# EAGLE design CAN_imp (EAGLE 6.4)
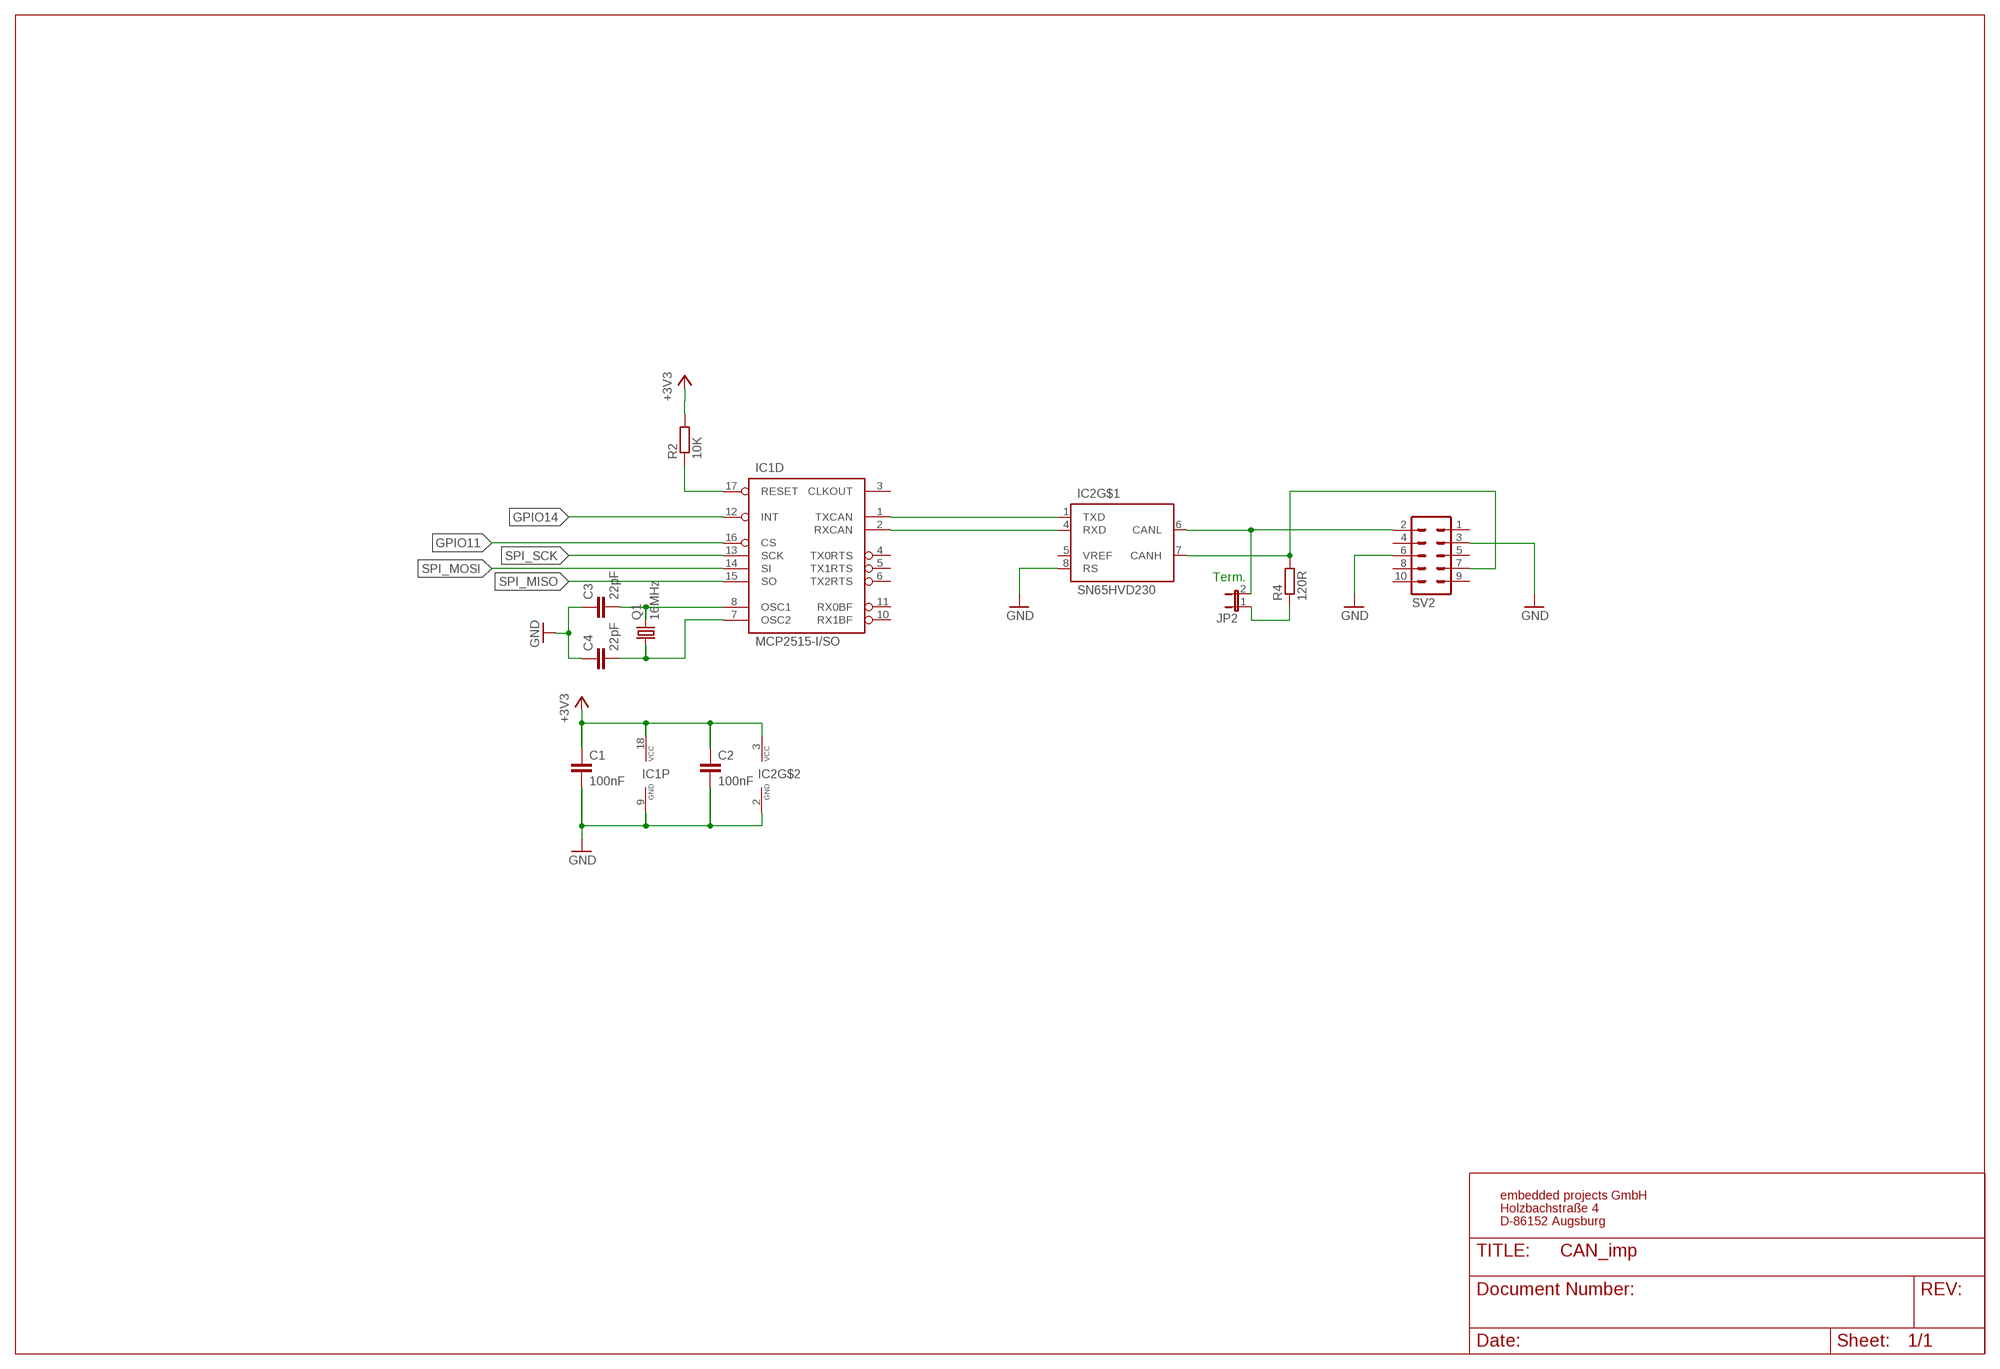
[diagram p0: schematic, sheet 1]

## Parts
C1  100nF  C-EUC0805  [C0805]
C2  100nF  C-EUC0805  [C0805]
C3  22pF  C-EUC0805  [C0805]
C4  22pF  C-EUC0805  [C0805]
IC1  MCP2515-I/SO  MCP2515SO  [SO-18W]
IC2  SN65HVD230  MCP2551SO8  [SO08]
JP2  JP1E  [JP1]
Q1  16MHz  CRYSTALHC49UP  [HC49UP]
R2  10K  R-EU_R0805  [R0805]
R4  120R  R-EU_R0805  [R0805]
SV2  ML10  [ML10]

## Nets
+3V3: C1.1 C2.1 IC1.18(P:VCC) IC2.3(VCC) R2.2
CANH: IC2.7(CANH) R4.2 SV2.7
CANL: IC2.6(CANL) JP2.2 SV2.2
GND: C1.2 C2.2 C3.1 C4.1 IC1.9(P:GND) IC2.2(GND) IC2.8(RS) SV2.3 SV2.6
GPIO11: IC1.16(D:CS)
GPIO14: IC1.12(D:INT)
N$2: C3.2 IC1.8(D:OSC1) Q1.2
N$3: C4.2 IC1.7(D:OSC2) Q1.1
N$4: IC1.1(D:TXCAN) IC2.1(TXD)
N$5: IC1.2(D:RXCAN) IC2.4(RXD)
N$6: IC1.17(D:RESET) R2.1
N$11: JP2.1 R4.1
SPI_MISO: IC1.15(D:SO)
SPI_MOSI: IC1.14(D:SI)
SPI_SCK: IC1.13(D:SCK)
Unconnected: IC1.3(D:CLKOUT) IC1.4(D:TX0RTS) IC1.5(D:TX1RTS) IC1.6(D:TX2RTS) IC1.10(D:RX1BF) IC1.11(D:RX0BF) IC2.5(VREF) SV2.1 SV2.4 SV2.5 SV2.8 SV2.9 SV2.10

## Notes on the sheet
- Term.
- embedded projects GmbH
- Holzbachstraße 4
- D-86152 Augsburg

## Library data of the parts
C1-C4 = rcl:C-EU: CAPACITOR, European symbol
IC1 = can:MCP2515: MC2515 Stand-Alone CAN Controller With SPI Interface, Microchip; FARNELL: 1292239
IC2 = can:MCP2551: CAN Tranceiver Microchip; FARNELL: 1103105
JP2 = jumper:JP1E: JUMPER
Q1 = crystal:CRYSTAL: CRYSTAL; OC_FARNELL: unknown; OC_NEWARK: unknown
R2 R4 = rcl:R-EU_: RESISTOR, European symbol
SV2 = con-ml:ML10: HARTING

## Board
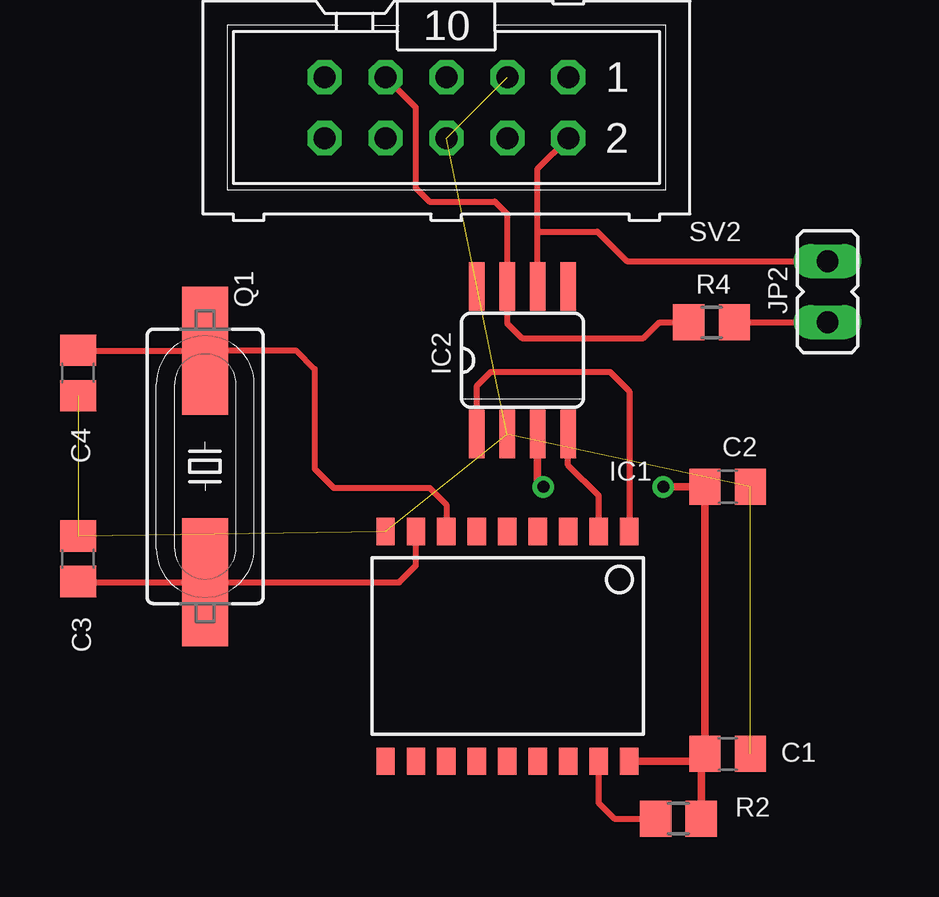
[diagram p1: board, top side]
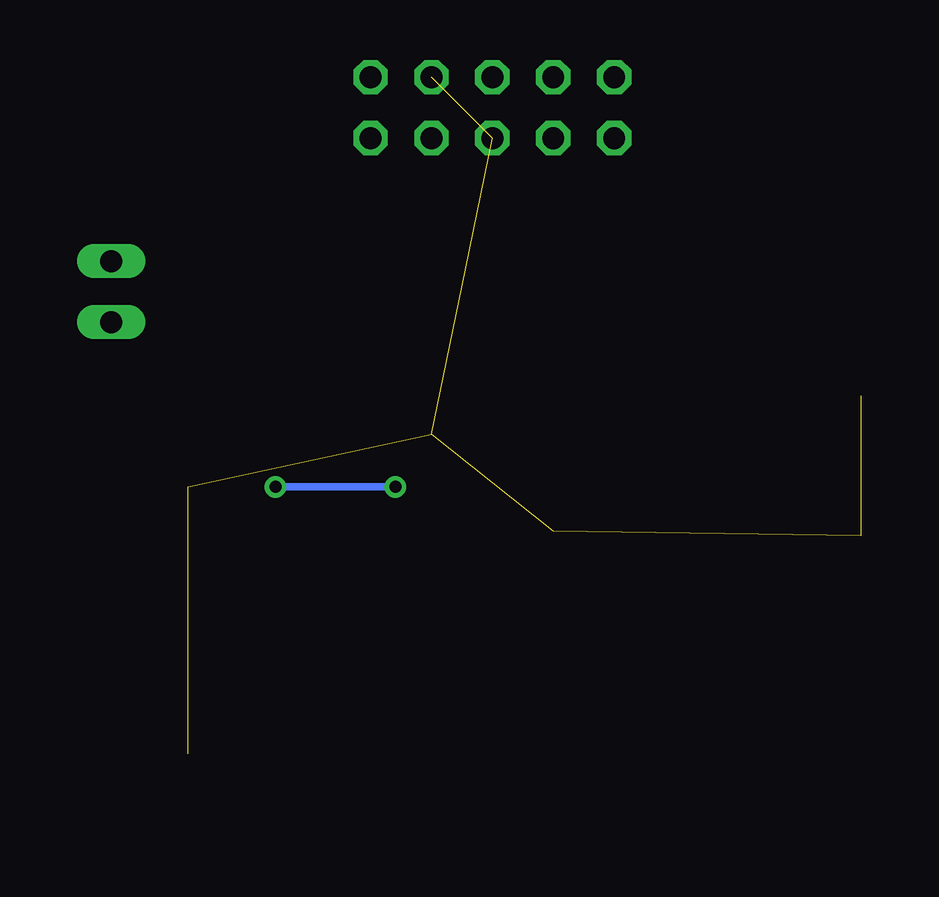
[diagram p2: board, bottom side, seen from below]

No outline drawn. Coordinates in mm, seen from the top.
Copper layers (1*16): Top 0.035mm / dielectric 1.5mm / Bottom 0.035mm
Design rules "default *": minimum track width 10mil, minimum drill 24mil, track to track 8mil, track to pad 8mil, pad to pad 8mil, via to via 8mil, smd to smd 8mil, copper to edge 20mil, drill to drill 8mil, minimum pad ring 10mil, minimum via ring 8mil, stop-mask expansion 2mil, vias tented up to drill 40mil, thermal gap 10mil

### Footprints (pad centres in the part's own frame; a part is rotated, then mirrored left to right if it is on the bottom)
C0805 = smd 1.3 x 1.5: 1 -0.95,0; 2 0.95,0
SO-18W = smd 0.762 x 1.143: 1 -5.08,-4.788; 2 -3.81,-4.788; 3 -2.54,-4.788; 4 -1.27,-4.788; 5 0,-4.788; 6 1.27,-4.788; 7 2.54,-4.788; 8 3.81,-4.788; 9 5.08,-4.788; 10 5.08,4.788; 11 3.81,4.788; 12 2.54,4.788; 13 1.27,4.788; 14 0,4.788; 15 -1.27,4.788; 16 -2.54,4.788; 17 -3.81,4.788; 18 -5.08,4.788
SO08 = smd 0.66 x 2.032: 1 -1.905,-3.073; 2 -0.635,-3.073; 3 0.635,-3.073; 4 1.905,-3.073; 5 1.905,3.073; 6 0.635,3.073; 7 -0.635,3.073; 8 -1.905,3.073
JP1 = drill 0.914 long: 1 0,-1.27; 2 0,1.27
HC49UP = smd 5.334 x 1.93: 1 -4.826,0; 2 4.826,0
R0805 = smd 1.3 x 1.5: 1 -0.95,0; 2 0.95,0
ML10 = drill 0.914 octagon: 1 -5.08,-1.27; 2 -5.08,1.27; 3 -2.54,-1.27; 4 -2.54,1.27; 5 0,-1.27; 6 0,1.27; 7 2.54,-1.27; 8 2.54,1.27; 9 5.08,-1.27; 10 5.08,1.27

### Placement (x,y rotation side)
C1  30.72,13.67 0 top
C2  30.72,24.8 0 top
C3  3.64,21.8 270 top
C4  3.64,29.54 90 top
IC1  21.54,18.15 180 top
IC2  22.17,30.07 0 top
JP2  34.89,32.93 0 top
Q1  8.94,25.65 270 top
R2  28.67,10.97 0 top
R4  30.05,31.65 180 top
SV2  19,40.6 180 top

### Tracks (layer width: path | path; a pad name or v marks a point on that pad's centre or on a via)
+3V3  (via drill 0.5)
  Top 0.305: R2.2 29.62,13.52 C1.1 | IC1.18 27.92,13.36 29.46,13.36 C1.1 | C1.1 29.77,16.13 | 29.77,16.13 29.77,16.27 | 29.77,16.27 C2.1 v28.04,24.79 | IC2.3 22.8,25.02 v23.04,24.79 | 29.77,16.13 29.77,16.27
  Bottom 0.305: v28.04,24.79 v23.04,24.79
CANH
  Top 0.254: R4.2 27.88,31.65 27.22,30.99 22.16,30.99 21.54,31.61 IC2.7 21.54,36.16 21.02,36.68 18.29,36.68 17.73,37.24 17.73,40.6 SV2.7
CANL
  Top 0.254: IC2.6 22.8,35.35 | JP2.2 26.52,34.2 25.29,35.43 22.89,35.43 22.8,35.35 | 22.8,35.35 22.8,38.05 SV2.2
GND  (8 unrouted)
N$2
  Top 0.254: IC1.8 17.73,21.52 17.03,20.82 Q1.2 3.67,20.82 C3.2
N$3
  Top 0.254: C4.2 3.65,30.48 Q1.1 12.73,30.48 13.51,29.7 13.51,25.54 14.3,24.75 18.3,24.75 19,24.05 IC1.7
N$4
  Top 0.254: IC1.1 26.62,28.77 25.82,29.59 20.85,29.59 20.27,29 IC2.1
N$5
  Top 0.254: IC2.4 24.07,25.7 25.35,24.43 IC1.2
N$6
  Top 0.254: R2.1 26,10.97 25.35,11.62 IC1.17
N$11
  Top 0.254: R4.1 JP2.1

### Text on the board
tDocu: CANH | CANL | Term. | www.gnublin.org